# Altium schematic sheet Top Level.SchDoc
size A4
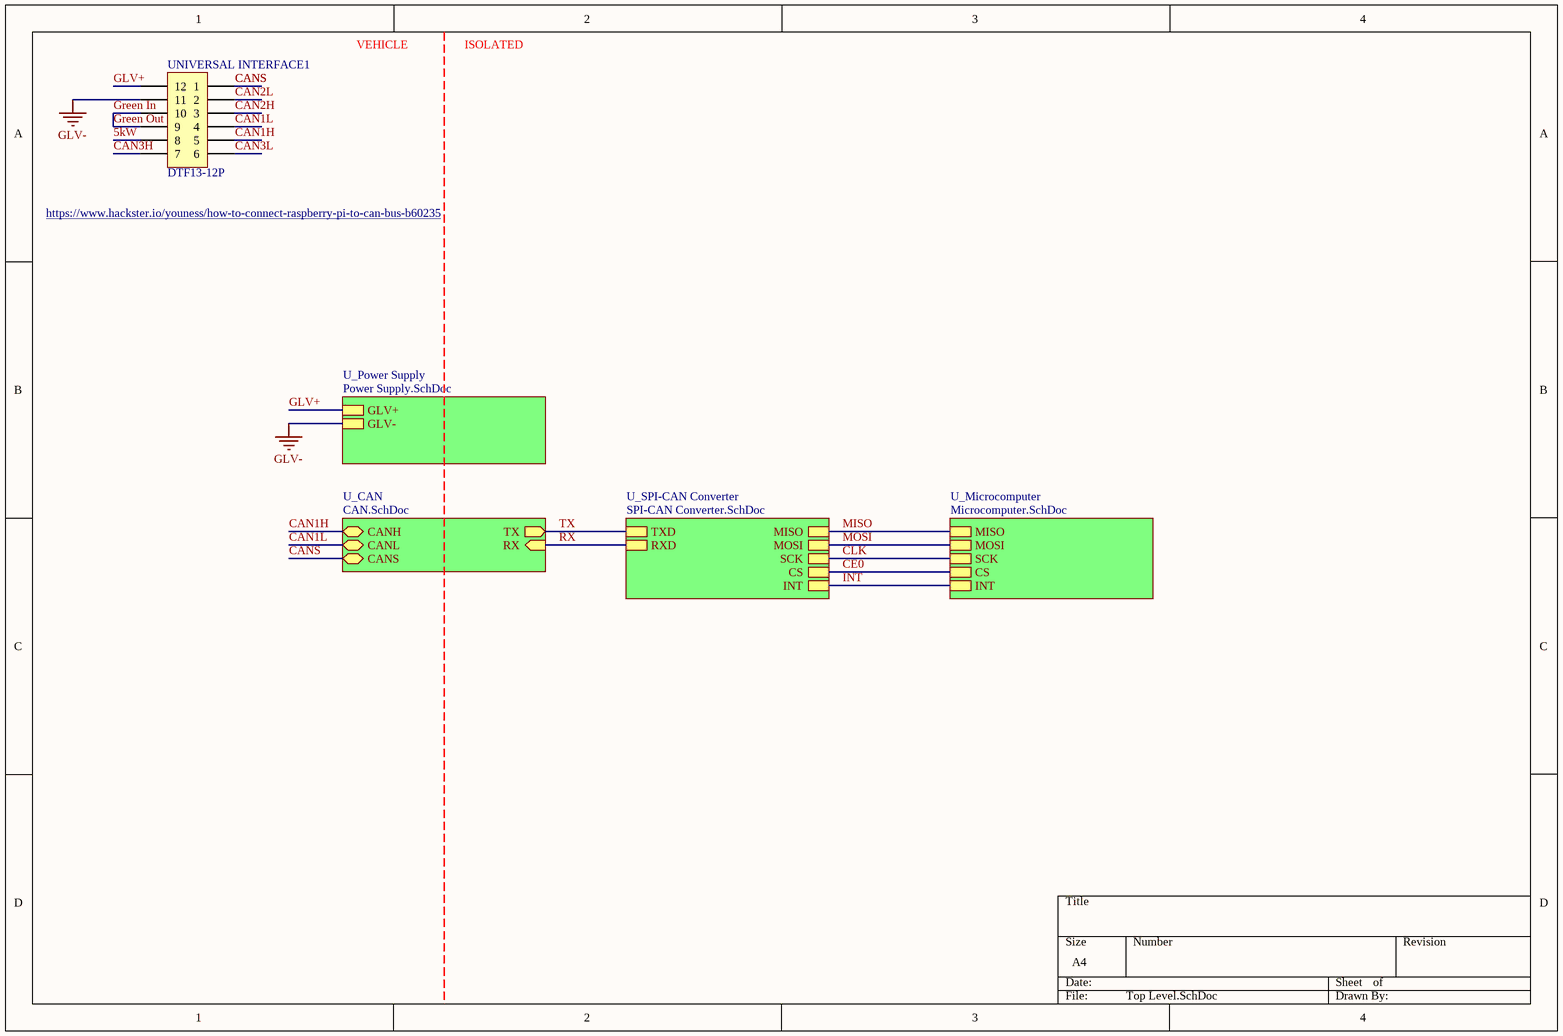
[diagram p0: Top Level.SchDoc]

## Parts
UNIVERSAL_INTERFACE1  DTF13-12P  [DTF13-12P]

## Sub-sheets
U_CAN = CAN.SchDoc: CANS (bidir), RX (in), CANL (bidir), CANH (bidir), TX (out)
U_Microcomputer = Microcomputer.SchDoc: MISO, MOSI, SCK, CS, INT
U_Power Supply = Power Supply.SchDoc: GLV+, GLV-
U_SPI-CAN Converter = SPI-CAN Converter.SchDoc: TXD, RXD, MISO, MOSI, SCK, CS, INT

## Nets
GLV-: UNIVERSAL_INTERFACE1.11 ; sheet U_Power Supply/GLV-
5kW: UNIVERSAL_INTERFACE1.8
CAN1H: UNIVERSAL_INTERFACE1.5 ; sheet U_CAN/CANH
CAN1L: UNIVERSAL_INTERFACE1.4 ; sheet U_CAN/CANL
CAN2H: UNIVERSAL_INTERFACE1.3
CAN2L: UNIVERSAL_INTERFACE1.2
CAN3H: UNIVERSAL_INTERFACE1.7
CAN3L: UNIVERSAL_INTERFACE1.6
CANS: UNIVERSAL_INTERFACE1.1 ; sheet U_CAN/CANS
CE0: sheet U_SPI-CAN Converter/CS, sheet U_Microcomputer/CS
CLK: sheet U_SPI-CAN Converter/SCK, sheet U_Microcomputer/SCK
GLV+: UNIVERSAL_INTERFACE1.12 ; sheet U_Power Supply/GLV+
Green In: UNIVERSAL_INTERFACE1.9 UNIVERSAL_INTERFACE1.10  [also labelled Green Out]
INT: sheet U_SPI-CAN Converter/INT, sheet U_Microcomputer/INT
MISO: sheet U_SPI-CAN Converter/MISO, sheet U_Microcomputer/MISO
MOSI: sheet U_SPI-CAN Converter/MOSI, sheet U_Microcomputer/MOSI
RX: sheet U_CAN/RX, sheet U_SPI-CAN Converter/RXD
TX: sheet U_CAN/TX, sheet U_SPI-CAN Converter/TXD

## Notes on the sheet
- VEHICLE
- ISOLATED
- https://www.hackster.io/youness/how-to-connect-raspberry-pi-to-can-bus-b60235

## Library data of the parts
UNIVERSAL_INTERFACE1 = DTF13-12P[[/\]]DTF13-12P: Positions: 12; Pitch: 4.45mm; Angle: 90; Flange: Yes; Contact: Nickel; Part Number: DTF13-12P; Row Spacing: 4.45mm; Digikey Part Number: 1734-1861-ND; Digikey Link: https://www.digikey.com/product-detail/en/te-connectivity-deutsch-connectors/DTF13-12PA/1734-1861-ND/9744662